# EAGLE design Window (EAGLE 6.6.0)
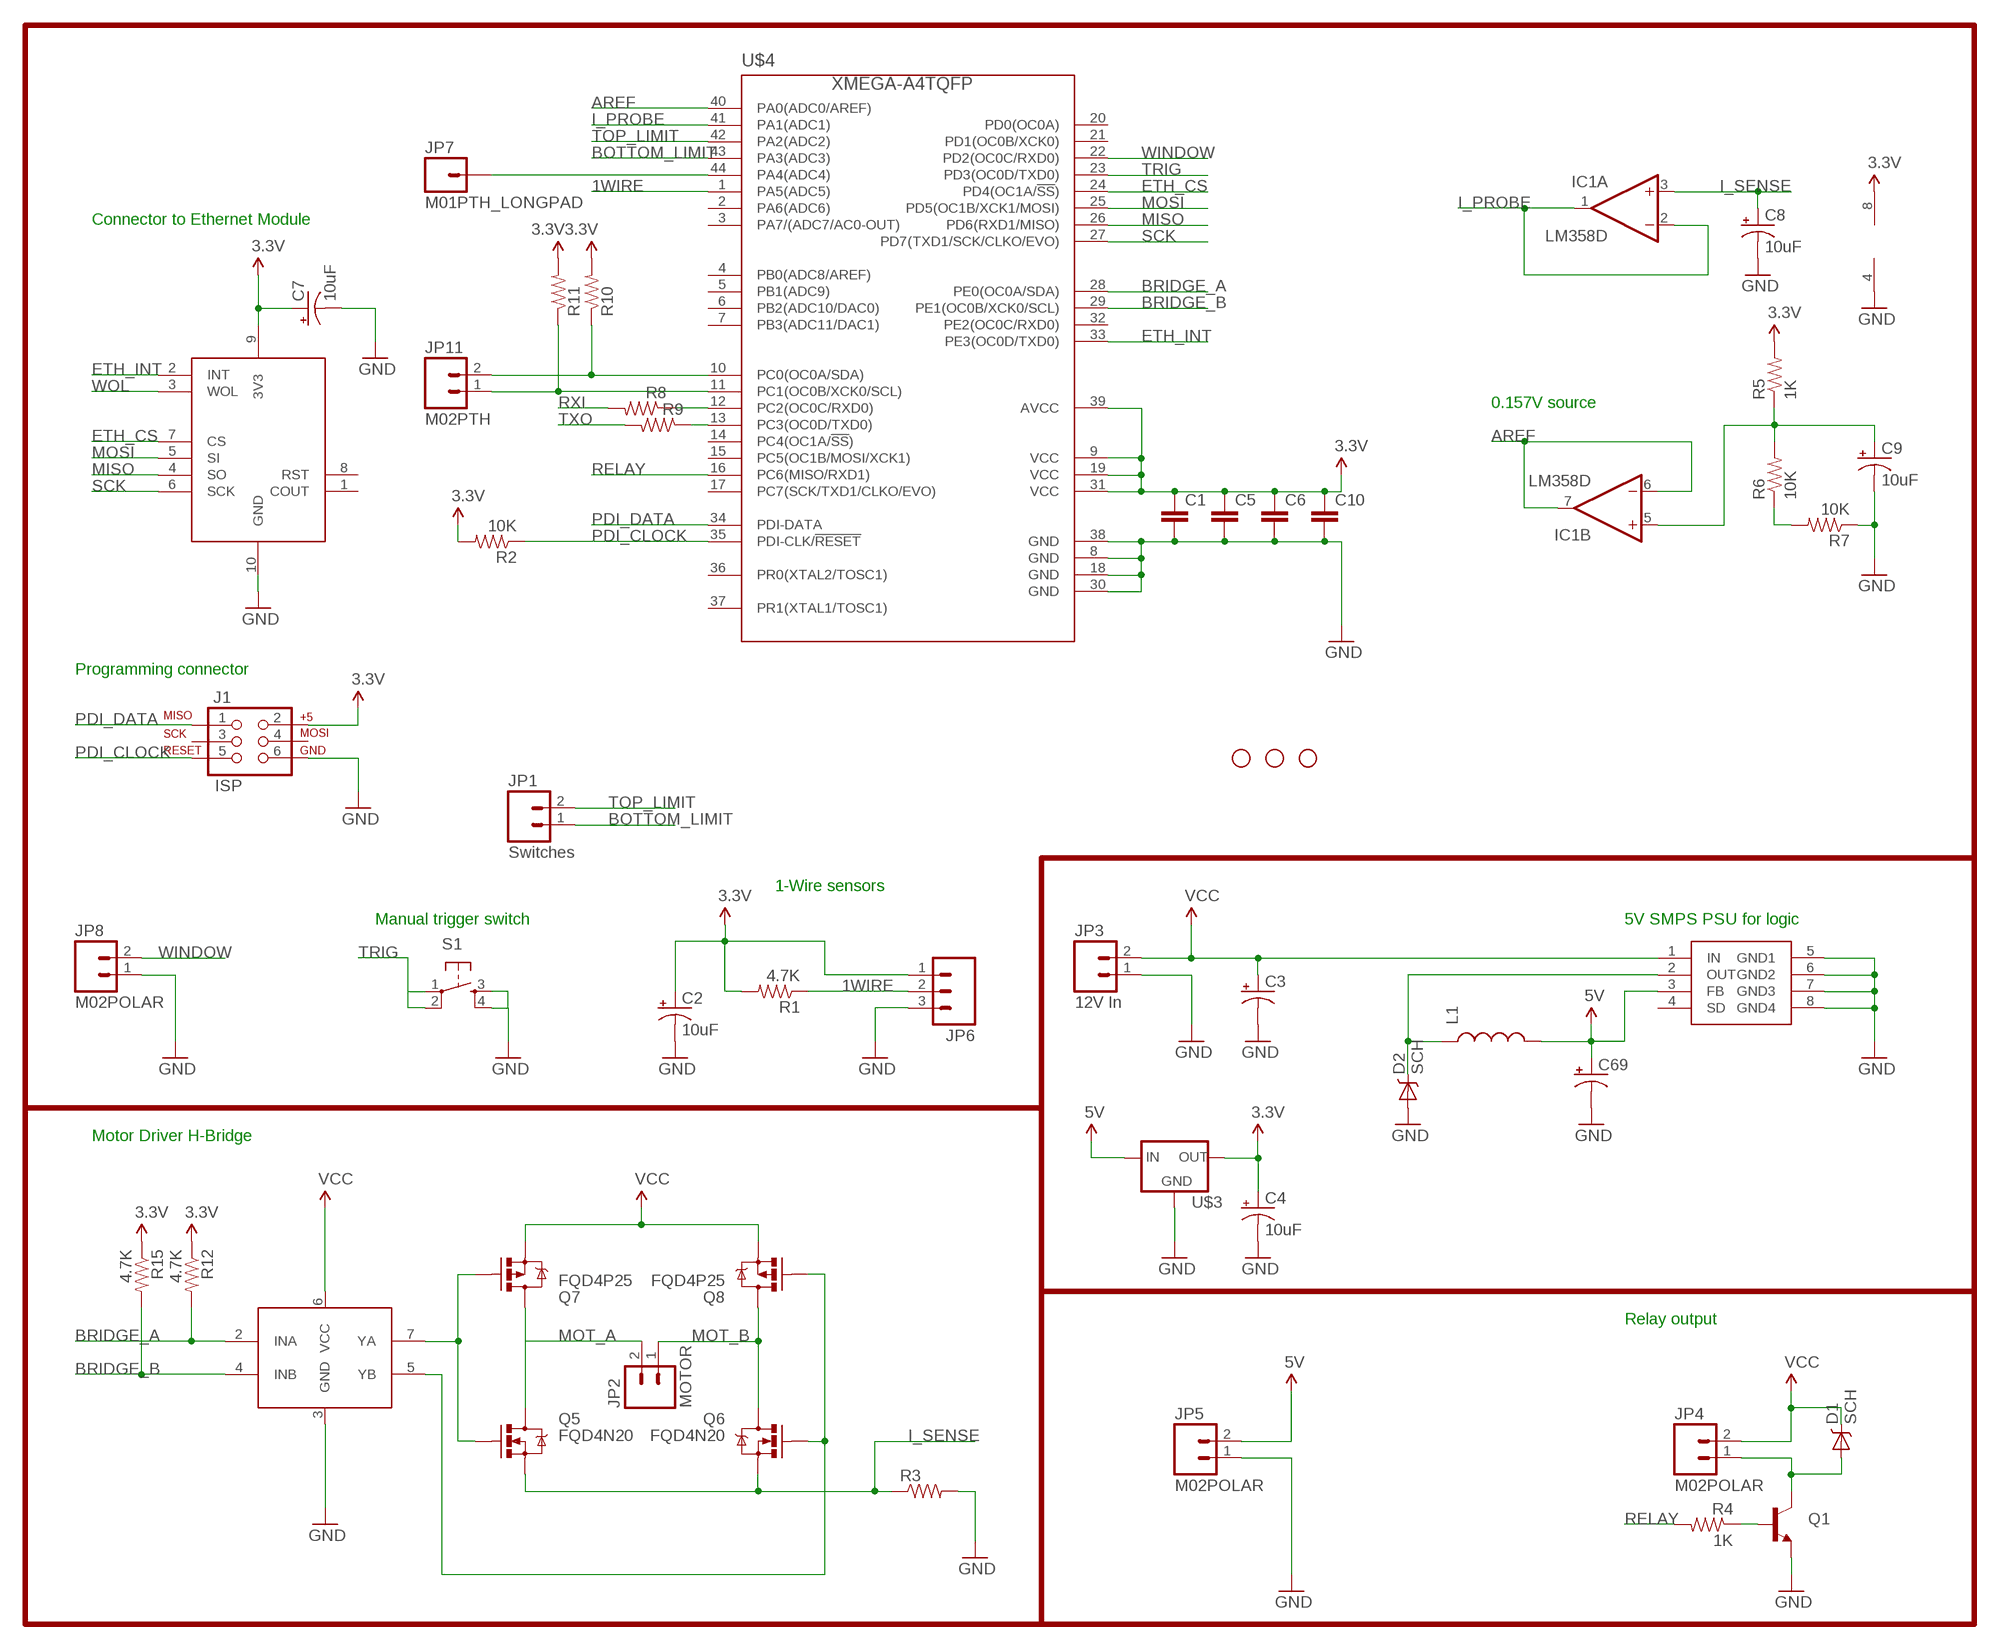
[diagram p0: schematic, sheet 1, part 1 of 2]
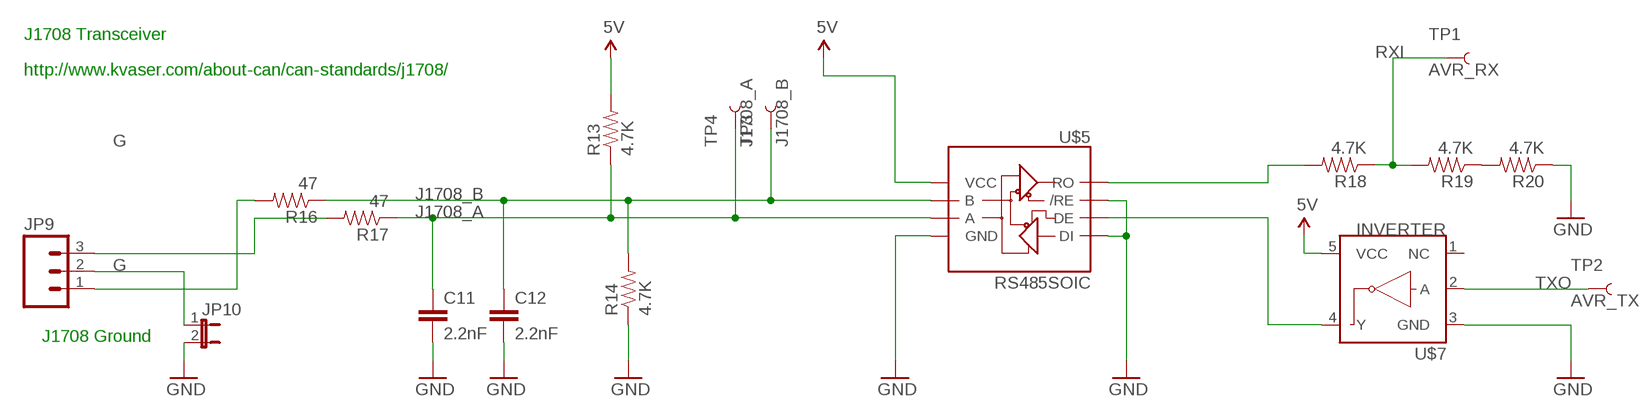
[diagram p1: schematic, sheet 1, part 2 of 2]

## Parts
C1  CAP0603-CAP  [0603-CAP]
C2  10uF  CAP_POL1206  [EIA3216]
C3  CAP_POLPTH1  [CPOL-RADIAL-100UF-25V]
C4  10uF  CAP_POL1206  [EIA3216]
C5  CAP0603-CAP  [0603-CAP]
C6  CAP0603-CAP  [0603-CAP]
C7  10uF  CAP_POL1206  [EIA3216]
C8  10uF  CAP_POL1206  [EIA3216]
C9  10uF  CAP_POL1206  [EIA3216]
C10  CAP0603-CAP  [0603-CAP]
C11  2.2nF  CAP0603-CAP  [0603-CAP]
C12  2.2nF  CAP0603-CAP  [0603-CAP]
C69  CAP_POLPTH1  [CPOL-RADIAL-100UF-25V]
D1  SCH  DIODE-SCHOTTKY_  [SMA-DIODE]
D2  SCH  DIODE-SCHOTTKY_  [SMA-DIODE]
IC1  LM358D  [SO08]
J1  ISP  AVR_SPI_PRG_6PTH  [2X3]
JP1  Switches  M023.5MM  [SCREWTERMINAL-3.5MM-2]
JP2  MOTOR  M023.5MM  [SCREWTERMINAL-3.5MM-2]
JP3  12V In  M023.5MM  [SCREWTERMINAL-3.5MM-2]
JP4  M02POLAR  [MOLEX-1X2]
JP5  M02POLAR  [MOLEX-1X2]
JP6  M03POLAR  [MOLEX-1X3]
JP7  M01PTH_LONGPAD  [1X01_LONGPAD]
JP8  M02POLAR  [MOLEX-1X2]
JP9  M03POLAR  [MOLEX-1X3]
JP10  JUMPER-2PTH  [1X02]
JP11  M02PTH  [1X02]
L1  INDUCTOR1206H*  [INDUCTOR-1206]
Q1  TRANSISTOR_NPNSOT23  [SOT23]
Q5  FQD4N20  MOSFET-NCHANNELFDD8780  [DPAK]
Q6  FQD4N20  MOSFET-NCHANNELFDD8780  [DPAK]
Q7  FQD4P25  MOSFET-PCHANNEL  [DPAK]
Q8  FQD4P25  MOSFET-PCHANNEL  [DPAK]
R1  4.7K  RESISTOR1206  [1206]
R2  10K  RESISTOR1206  [1206]
R3  RESISTORPTH-1W  [AXIAL-0.6]
R4  1K  RESISTOR1206  [1206]
R5  1K  RESISTOR1206  [1206]
R6  10K  RESISTOR1206  [1206]
R7  10K  RESISTOR1206  [1206]
R8  RESISTOR0603-RES  [0603-RES]
R9  RESISTOR0603-RES  [0603-RES]
R10  RESISTOR0603-RES  [0603-RES]
R11  RESISTOR0603-RES  [0603-RES]
R12  4.7K  RESISTOR1206  [1206]
R13  4.7K  RESISTOR1206  [1206]
R14  4.7K  RESISTOR1206  [1206]
R15  4.7K  RESISTOR1206  [1206]
R16  47  RESISTOR1206  [1206]
R17  47  RESISTOR1206  [1206]
R18  4.7K  RESISTOR1206  [1206]
R19  4.7K  RESISTOR1206  [1206]
R20  4.7K  RESISTOR1206  [1206]
S1  TAC_SWITCHPTH  [TACTILE-PTH]
STANDOFF2  STAND-OFF  [STAND-OFF]
STANDOFF3  STAND-OFF  [STAND-OFF]
STANDOFF4  STAND-OFF  [STAND-OFF]
TP1  AVR_RX  TEST-POINT3X5  [PAD.03X.05]
TP2  AVR_TX  TEST-POINT3X5  [PAD.03X.05]
TP3  J1708_B  TEST-POINT3X5  [PAD.03X.05]
TP4  J1708_A  TEST-POINT3X5  [PAD.03X.05]
U$1  ETHMODULE  [2X5]
U$2  AP1509-33  [SOIC-8]
U$3  V_REG_MIC2920  [SOT223]
U$4  XMEGA-A4TQFP  [TQFP44]
U$5  RS485SOIC  [SO08]
U$6  4427  [SOIC-8]
U$7  INVERTER  [SOT23-5]

## Nets
1WIRE: JP6.2 R1.1 U$4.1(PA5(ADC5))
3.3V: C1.1 C2.A(+) C4.A(+) C5.1 C6.1 C7.A(+) C10.1 IC1.8(P:V+) J1.2 JP6.1 R1.2 R2.2 R5.2 R10.2 R11.2 R12.1 R15.1 U$1.9(3V3) U$3.3(OUT) U$4.9(VCC) U$4.19(VCC) U$4.31(VCC) U$4.39(AVCC)
5V: C69.1(+) JP5.2 L1.P$2 R13.2 U$2.3(FB) U$3.1(IN) U$5.8(VCC) U$7.5(VCC)
AREF: IC1.6(B:-IN) IC1.7(B:OUT) U$4.40(PA0(ADC0/AREF))
BOTTOM_LIMIT: JP1.1 U$4.43(PA3(ADC3))
BRIDGE_A: R12.2 U$4.28(PE0(OC0A/SDA)) U$6.2(INA)
BRIDGE_B: R15.2 U$4.29(PE1(OC0B/XCK0/SCL)) U$6.4(INB)
ETH_CS: U$1.7(CS) U$4.24(PD4(OC1A/!SS!))
ETH_INT: U$1.2(INT) U$4.33(PE3(OC0D/TXD0))
G: JP9.2 JP10.1
GND: C1.2 C2.C(-) C3.2(-) C4.C(-) C5.2 C6.2 C7.C(-) C8.C(-) C9.C(-) C10.2 C11.2 C12.2 C69.2(-) D2.A IC1.4(P:V-) J1.6 JP3.1 JP5.1 JP6.3 JP8.1 JP10.2 Q1.2(E) R3.P$2 R7.1 R14.1 R20.1 S1.3 S1.4 U$1.10(GND) U$2.5(GND1) U$2.6(GND2) U$2.7(GND3) U$2.8(GND4) U$3.2(GND) U$4.8(GND) U$4.18(GND) U$4.30(GND) U$4.38(GND) U$5.2(/RE) U$5.4(DI) U$5.5(GND) U$6.3(GND) U$7.3(GND)
I_PROBE: IC1.1(A:OUT) IC1.2(A:-IN) U$4.41(PA1(ADC1))
I_SENSE: C8.A(+) IC1.3(A:+IN) Q5.3(S) Q6.3(S) R3.P$1
J1708_A: C11.1 R13.1 R17.1 TP4.P$1 U$5.6(A)
J1708_B: C12.1 R14.2 R16.1 TP3.P$1 U$5.7(B)
MISO: U$1.4(SO) U$4.26(PD6(RXD1/MISO))
MOSI: U$1.5(SI) U$4.25(PD5(OC1B/XCK1/MOSI))
MOT_A: JP2.2 Q5.4(D) Q7.4(D)
MOT_B: JP2.1 Q6.4(D) Q8.4(D)
N$1: JP11.2 R10.1 U$4.10(PC0(OC0A/SDA))
N$2: JP11.1 R11.1 U$4.11(PC1(OC0B/XCK0/SCL))
N$3: D2.C L1.P$1 U$2.2(OUT)
N$4: R8.1 U$4.12(PC2(OC0C/RXD0))
N$5: D1.A JP4.1 Q1.3(C)
N$6: JP9.1 R16.2
N$7: R6.1 R7.2
N$8: Q5.1(G) Q7.1(G) U$6.7(YA)
N$9: Q1.1(B) R4.1
N$10: C9.A(+) IC1.5(B:+IN) R5.1 R6.2
N$11: R9.1 U$4.13(PC3(OC0D/TXD0))
N$12: JP9.3 R17.2
N$13: R18.2 U$5.1(RO)
N$14: R19.1 R20.2
N$15: Q6.1(G) Q8.1(G) U$6.5(YB)
N$16: U$5.3(DE) U$7.4(Y)
N$17: JP7.1 U$4.44(PA4(ADC4))
PDI_CLOCK: J1.5 R2.1 U$4.35(PDI-CLK/!RESET)
PDI_DATA: J1.1 U$4.34(PDI-DATA)
RELAY: R4.2 U$4.16(PC6(MISO/RXD1))
RXI: R8.2 R18.1 R19.2 TP1.P$1
SCK: U$1.6(SCK) U$4.27(PD7(TXD1/SCK/CLKO/EVO))
TOP_LIMIT: JP1.2 U$4.42(PA2(ADC2))
TRIG: S1.1 S1.2 U$4.23(PD3(OC0D/TXD0))
TXO: R9.2 TP2.P$1 U$7.2(A)
VCC: C3.1(+) D1.C JP3.2 JP4.2 Q7.3(S) Q8.3(S) U$2.1(IN) U$6.6(VCC)
WINDOW: JP8.2 U$4.22(PD2(OC0C/RXD0))
WOL: U$1.3(WOL)
Unconnected: J1.3 J1.4 U$2.4(SD) U$4.2(PA6(ADC6)) U$4.3(PA7/(ADC7/AC0-OUT)) U$4.4(PB0(ADC8/AREF)) U$4.5(PB1(ADC9)) U$4.6(PB2(ADC10/DAC0)) U$4.7(PB3(ADC11/DAC1)) U$4.14(PC4(OC1A/!SS!)) U$4.15(PC5(OC1B/MOSI/XCK1)) U$4.17(PC7(SCK/TXD1/CLKO/EVO)) U$4.20(PD0(OC0A)) U$4.21(PD1(OC0B/XCK0)) U$4.32(PE2(OC0C/RXD0)) U$4.36(PR0(XTAL2/TOSC1)) U$4.37(PR1(XTAL1/TOSC1)) U$7.1(NC)

## Notes on the sheet
- Connector to Ethernet Module
- 0.157V source
- Programming connector
- 1-Wire sensors
- Manual trigger switch | 5V SMPS PSU for logic
- Motor Driver H-Bridge
- J1708 Transceiver
- http://www.kvaser.com/about-can/can-standards/j1708/
- Relay output
- J1708 Ground

## Power pins joined to a net without a drawn wire
COUT: U$1.1(COUT)
RST: U$1.8(RST)

## Library data of the parts
C1 C5 C6 C10-C12 = 1_SparkFun-Capacitors:CAP: Capacitor Standard 0603 ceramic capacitor, and 0.1" leaded capacitor.
C2-C4 C7-C9 C69 = 1_SparkFun-Capacitors:CAP_POL: Capacitor Polarized These are standard SMD and PTH capacitors. Normally 10uF, 47uF, and 100uF in electrolytic and tantalum varieties. Always verify the external diameter of the through hole cap, it varies with capacity, voltage, and manufacturer. The EIA devices should be standard.
D1 D2 = 1_SparkFun-DiscreteSemi:DIODE-SCHOTTKY: Commonly MBRA140.
IC1 = linear:LM358: OP AMP also LM158; LM258; LM2904 Source: http://cache.national.com/ds/LM/LM158.pdf
J1 = 1_SparkFun-Connectors:AVR_SPI_PRG_6: AVR ISP 6 Pin This is the reduced ISP connector for AVR programming. Common on Arduino. This footprint will take up less PCB space and can be used with a 10-pin to 6-pin adapter such as SKU: BOB-08508
JP1-JP5 JP8 JP11 = 1_SparkFun-Connectors:M02: Standard 2-pin 0.1" header. Use with - straight break away headers ( PRT-00116) - right angle break away headers (PRT-00553) - swiss pins (PRT-00743) - machine pins (PRT-00117) - female headers (PRT-00115) Molex polarized connector foot print use with: PRT-08233 with associated crimp pins and housings. 2.54_SCREWTERM for use with PRT-10571. 3.5mm Screw Terminal footprints for PRT-08084 5mm Screw Terminal footprints for use with PRT-08433
JP6 JP9 = 1_SparkFun-Connectors:M03: Header 3 Standard 3-pin 0.1" header. Use with straight break away headers (SKU : PRT-00116), right angle break away headers (PRT-00553), swiss pins (PRT-00743), machine pins (PRT-00117), and female headers (PRT-00115). Molex polarized connector foot print use with SKU : PRT-08232 with associated crimp pins and housings.
JP7 = 1_SparkFun-Connectors:M01: Header 1 Standard 1-pin 0.1" header. Use with straight break away headers (SKU : PRT-00116), right angle break away headers (PRT-00553), swiss pins (PRT-00743), machine pins (PRT-00117), and female headers (PRT-00115).
JP10 = 1_SparkFun-Passives:JUMPER-2: Jumper Basic 0.1" spaced jumper. Use with breakaway headers.
L1 = 1_SparkFun-Passives:INDUCTOR: Inductors Basic Inductor/Choke - 0603 and 1206. Footprints are not proven and vary greatly between part numbers. SRN6045- 33uH, 20% 1.4A SDR0403-560KL - 56uH, 10%, 500mA RMS/740mA peak
Q1 = 1_SparkFun-DiscreteSemi:TRANSISTOR_NPN: Generic NPN BJT MMBT2222A - TRANS-08049 (SOT-23, 1A 40V) MPSA42 - TRANS-09116 (SOT-23, 500mA 300V) MMBT5088LT1G - TRANS-11160 (SOT-23, 50 mA 30V)
Q5 Q6 = 1_SparkFun-DiscreteSemi:MOSFET-NCHANNEL: Common NMOSFET Parts MFG P/N Store ID Prod ID FDD8780 TRANS-09984 SI7820DN TRANS-11055 FDS6630A IC-08089 2N7002PW TRANS-11151 FQP30N06L COM-10213 TRANS-10060 BSS123LT1G TRANS-08345 BSS138 TRANS-00830 BS170 2N7000; PROD_ID: TRANS-09984
Q7 Q8 = 1_SparkFun-DiscreteSemi:MOSFET-PCHANNEL: Generic PMOSFET
R1-R20 = 1_SparkFun-Resistors:RESISTOR: Resistor Basic schematic elements and footprints for 0603, 1206, and PTH resistors.
S1 = 1_SparkFun-Electromechanical:TAC_SWITCH: Momentary Switch Button commonly used for reset or general input. Spark Fun Electronics SKU : COM-00097 SMT- SWCH-08247
STANDOFF2-STANDOFF4 = 1_SparkFun-Electromechanical:STAND-OFF: #4 Stand Off This is the mechanical footprint for a #4 phillips button head screw. Use the keepout ring to avoid running the screw head into surrounding components. SKU : PRT-00447
TP1-TP4 = 1_SparkFun-Passives:TEST-POINT: Bare copper test points for troubleshooting or ICT
U$1 = 0_Tristan's_Lib:ETHMODULE
U$2 = 0_Tristan's_Lib:AP1509-33
U$3 = 1_SparkFun-PowerIC:V_REG_MIC2920: MIC2920A (http://www.micrel.com/_PDF/mic2920.pdf) - 400mA output LDO Regulator
U$4 = avr-7:XMEGA-A4: Atmel XMega A4 series processor
U$5 = 1_SparkFun-DigitalIC:RS485: RS485 transceiver
U$6 = 0_Tristan's_Lib:4427: MOSFET driver IC
U$7 = 1_SparkFun-DigitalIC:INVERTER: Single inverter, SOT23-5

## Board
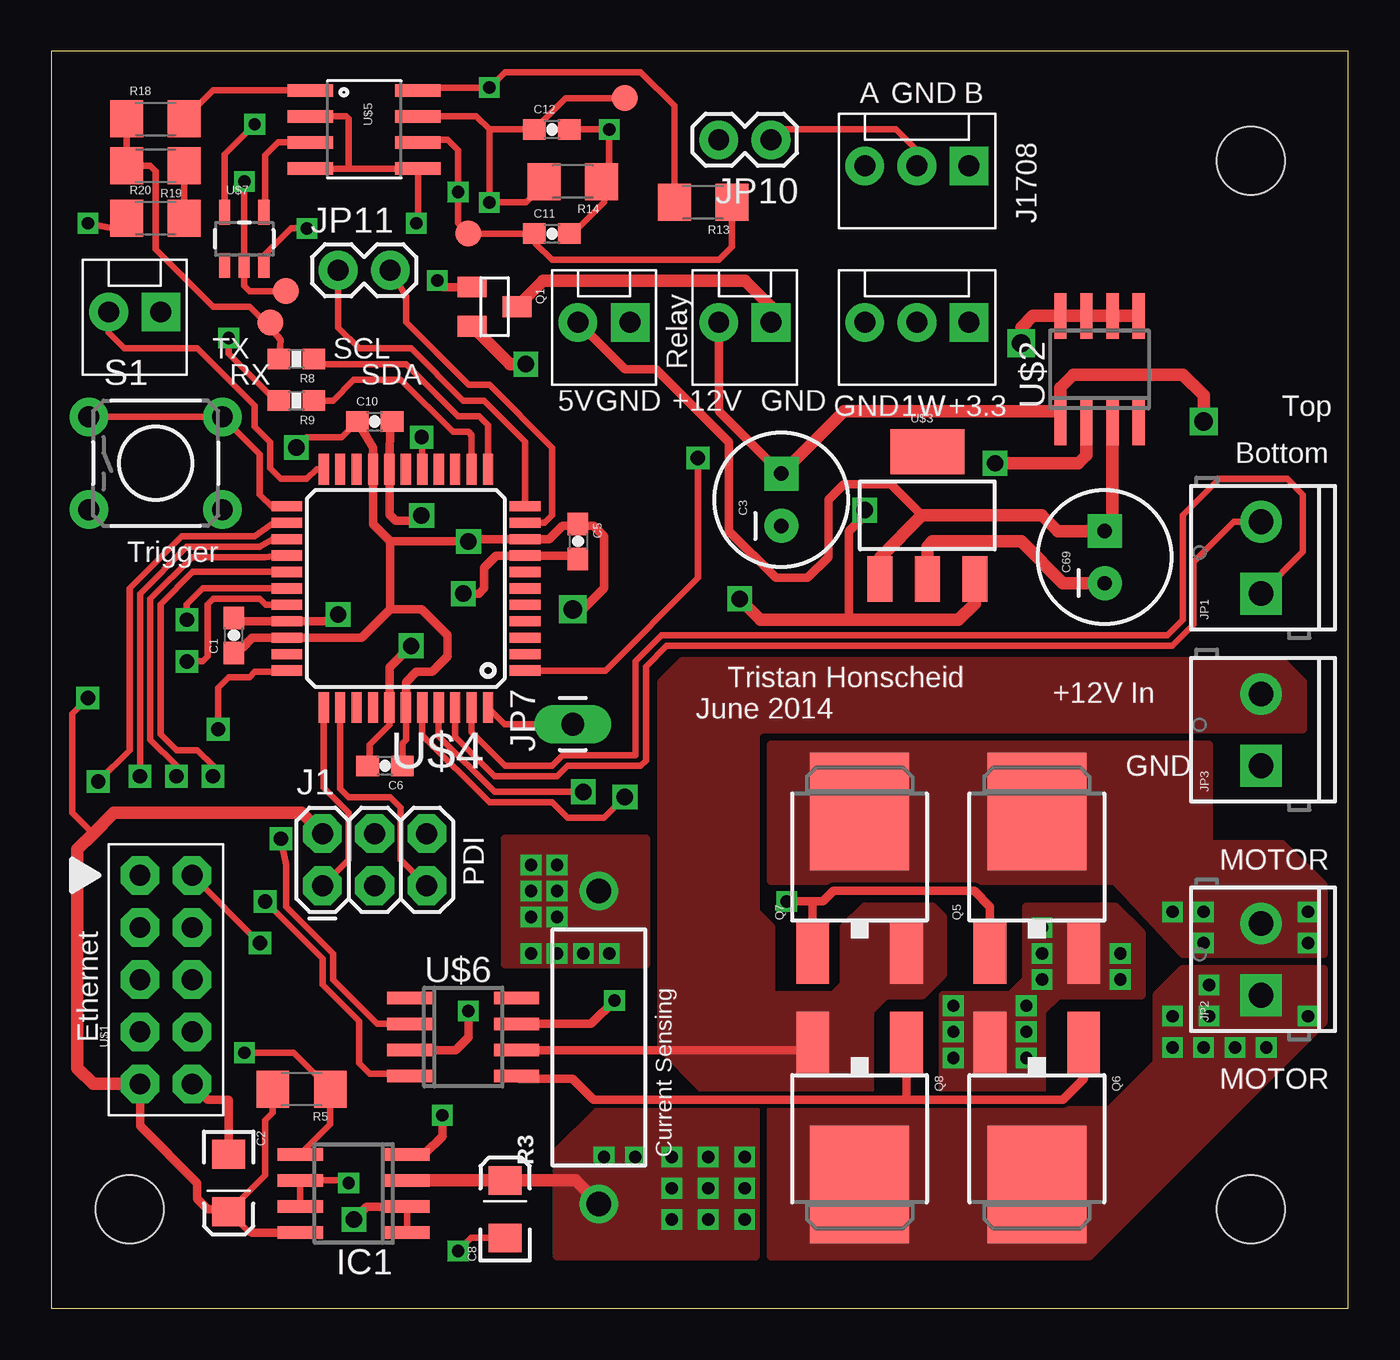
[diagram p2: board, top side]
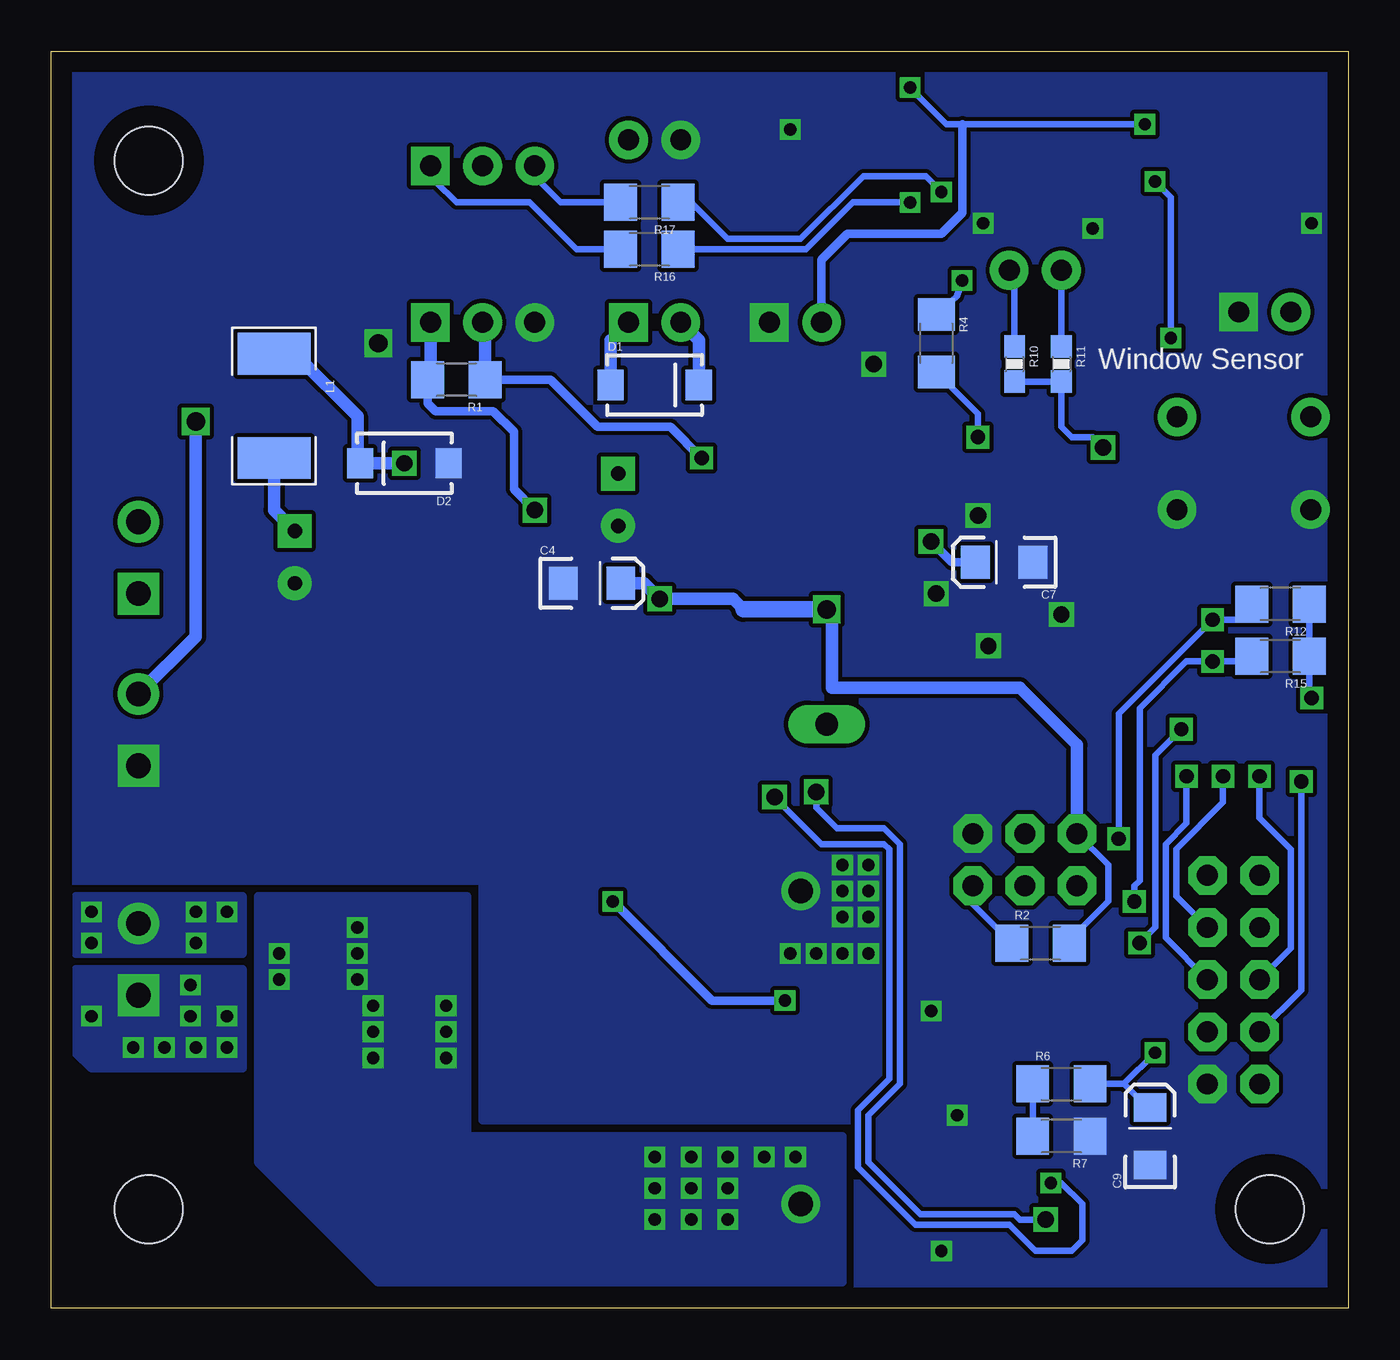
[diagram p3: board, bottom side, seen from below]

Size 63.17 x 61.2 mm. Coordinates in mm from the lower left corner, seen from the top.
Outline: 0,0 63.17,0 63.17,61.2 0,61.2 0,0
Copper layers (1*16): Top 0.035mm / dielectric 1.5mm / Bottom 0.035mm
Design rules "default": minimum track width 10mil, minimum drill 24mil, track to track 8mil, track to pad 8mil, pad to pad 8mil, via to via 8mil, smd to smd 8mil, copper to edge 40mil, drill to drill 8mil, minimum pad ring 10mil, minimum via ring 8mil, stop-mask expansion 4mil, vias tented up to drill 0mil, thermal gap 10mil

### Footprints (pad centres in the part's own frame; a part is rotated, then mirrored left to right if it is on the bottom)
0603-CAP = smd 1.1 x 1: 1 -0.85,0; 2 0.85,0
EIA3216 = smd 1.4 x 1.6: A 1.4,0; C -1.4,0
CPOL-RADIAL-100UF-25V = drill 0.7 pad 1.651 square: 1 1.27,0 | drill 0.7 pad 1.651: 2 -1.27,0
SMA-DIODE = smd 1.27 x 1.47: A -2.15,0; C 2.15,0
SO08 = smd 0.6 x 2.2: 1 -1.905,-2.6; 2 -0.635,-2.6; 3 0.635,-2.6; 4 1.905,-2.6; 5 1.905,2.6; 6 0.635,2.6; 7 -0.635,2.6; 8 -1.905,2.6
2X3 = drill 1.016 pad 1.88 octagon: 1 0,0; 2 0,2.54; 3 2.54,0; 4 2.54,2.54; 5 5.08,0; 6 5.08,2.54
SCREWTERMINAL-3.5MM-2 = drill 1.2 pad 2.032 square: 1 0,0 | drill 1.2 pad 2.032: 2 3.5,0
MOLEX-1X2 = drill 1.016 pad 1.88 square: 1 0,0 | drill 1.016 pad 1.88: 2 2.54,0
MOLEX-1X3 = drill 1.016 pad 1.88 square: 1 0,0 | drill 1.016 pad 1.88: 2 2.54,0; 3 5.08,0
1X01_LONGPAD = drill 1.118 pad 1.88 long: 1 0,0
1X02 = drill 1.016 pad 1.88: 1 0,0; 2 2.54,0
INDUCTOR-1206 = smd 2.032 x 3.556: P$1 -2.54,0; P$2 2.54,0
SOT23 = smd 1 x 1.4: 1 -0.95,-1.1; 2 0.95,-1.1; 3 0,1.1
DPAK = smd 1.6 x 3: 1 -2.28,-5.31; 3 2.28,-5.31 | smd 4.826 x 5.715: 4 0,1.588
1206 = smd 1.6 x 1.8: 1 -1.4,0; 2 1.4,0
AXIAL-0.6 = drill 1.2 pad 1.88: P$1 -7.62,0; P$2 7.62,0
0603-RES = smd 1.1 x 1: 1 -0.85,0; 2 0.85,0
TACTILE-PTH = drill 1.016 pad 1.88: 1 -3.251,2.261; 2 3.251,2.261; 3 -3.251,-2.261; 4 3.251,-2.261
STAND-OFF = hole 3.302: 0,0
PAD.03X.05 = smd 1.27 x 1.27: P$1 0,0
2X5 = drill 1.016 pad 1.88 octagon: 1 -1.27,5.08; 2 1.27,5.08; 3 -1.27,2.54; 4 1.27,2.54; 5 -1.27,0; 6 1.27,0; 7 -1.27,-2.54; 8 1.27,-2.54; 9 -1.27,-5.08; 10 1.27,-5.08
SOIC-8 = smd 0.6 x 2.2: 1 -1.905,-2.6; 2 -0.635,-2.6; 3 0.635,-2.6; 4 1.905,-2.6; 5 1.905,2.6; 6 0.635,2.6; 7 -0.635,2.6; 8 -1.905,2.6
SOT223 = smd 1.219 x 2.235: 1 -2.311,-3.099; 2 0,-3.099; 3 2.311,-3.099 | smd 3.6 x 2.2: 4 0,3.099
TQFP44 = smd 1.5 x 0.5: 1 -5.8,4; 2 -5.8,3.2; 3 -5.8,2.4; 4 -5.8,1.6; 5 -5.8,0.8; 6 -5.8,0; 7 -5.8,-0.8; 8 -5.8,-1.6; 9 -5.8,-2.4; 10 -5.8,-3.2; 11 -5.8,-4; 23 5.8,-4; 24 5.8,-3.2; 25 5.8,-2.4; 26 5.8,-1.6; 27 5.8,-0.8; 28 5.8,0; 29 5.8,0.8; 30 5.8,1.6; 31 5.8,2.4; 32 5.8,3.2; 33 5.8,4 | smd 0.5 x 1.5: 12 -4,-5.8; 13 -3.2,-5.8; 14 -2.4,-5.8; 15 -1.6,-5.8; 16 -0.8,-5.8; 17 0,-5.8; 18 0.8,-5.8; 19 1.6,-5.8; 20 2.4,-5.8; 21 3.2,-5.8; 22 4,-5.8; 34 4,5.8; 35 3.2,5.8; 36 2.4,5.8; 37 1.6,5.8; 38 0.8,5.8; 39 0,5.8; 40 -0.8,5.8; 41 -1.6,5.8; 42 -2.4,5.8; 43 -3.2,5.8; 44 -4,5.8
SO08' = smd 0.61 x 2.21: 1 -1.905,-2.616; 2 -0.635,-2.616; 3 0.635,-2.616; 4 1.905,-2.616; 5 1.905,2.616; 6 0.635,2.616; 7 -0.635,2.616; 8 -1.905,2.616
SOT23-5 = smd 0.55 x 1.2: 1 -0.95,-1.3; 2 0,-1.3; 3 0.95,-1.3; 4 0.95,1.3; 5 -0.95,1.3

### Placement (x,y rotation side)
C1  8.89,32.77 90 top
C2  8.64,6.1 270 top
C3  35.56,39.37 90 top
C4  36.83,35.31 0 bottom
C5  25.65,37.34 270 top
C6  16.26,26.42 180 top
C7  16.76,36.32 180 bottom
C8  22.1,4.83 90 top
C9  9.65,8.38 90 bottom
C10  15.75,43.18 0 top
C11  24.38,52.32 0 top
C12  24.38,57.4 0 top
C69  51.31,36.58 90 top
D1  33.78,44.96 0 bottom
D2  45.97,41.15 180 bottom
IC1  14.73,5.59 90 top
J1  13.21,20.57 0 top
JP1  58.93,34.8 90 top
JP2  58.93,15.24 90 top
JP3  58.93,26.42 90 top
JP4  35.05,48.01 180 top
JP5  28.19,48.01 180 top
JP6  44.7,48.01 180 top
JP7  25.4,28.45 90 top
JP8  5.33,48.51 180 top
JP9  44.7,55.63 180 top
JP10  35.05,56.9 180 top
JP11  13.97,50.55 0 top
L1  52.32,43.94 270 bottom
Q1  21.59,48.77 270 top
Q5  48.01,22.61 0 top
Q6  48.01,7.62 180 top
Q7  39.37,22.61 0 top
Q8  39.37,7.62 180 top
R1  43.43,45.21 180 bottom
R2  14.99,17.78 0 bottom
R3  26.67,12.7 90 top
R4  20.07,46.99 270 bottom
R5  12.19,10.67 180 top
R6  13.97,10.92 0 bottom
R7  13.97,8.38 180 bottom
R8  11.94,46.23 180 top
R9  11.94,44.2 180 top
R10  16.26,45.97 270 bottom
R11  13.97,45.97 270 bottom
R12  3.3,34.29 180 bottom
R13  31.75,53.85 180 top
R14  25.4,54.86 180 top
R15  3.3,31.75 180 bottom
R16  34.04,51.56 180 bottom
R17  34.04,53.85 180 bottom
R18  5.08,57.91 0 top
R19  5.08,55.63 180 top
R20  5.08,53.09 0 top
S1  5.08,41.15 0 top
STANDOFF2  58.42,55.88 0 top
STANDOFF3  58.42,4.83 0 top
STANDOFF4  3.81,4.83 0 top
TP1  10.67,48.01 0 top
TP2  11.43,49.53 0 top
TP3  27.94,58.93 0 top
TP4  20.32,52.32 0 top
U$1  5.59,16 0 top
U$2  51.05,45.72 0 top
U$3  42.67,38.61 0 top
U$4  17.27,35.05 180 top
U$5  RS485SOIC  [SO08']  15.24,57.4 270 top
U$6  20.07,13.21 270 top
U$7  9.4,52.07 0 top

### Tracks (layer width: path | path; a pad name or v marks a point on that pad's centre or on a via)
1WIRE  (via drill 0.7)
  Top 0.305: U$4.1 26.99,31.05 31.5,35.56 v31.5,41.4
  Bottom 0.406: R1.1 38.86,45.21 36.58,42.93 33.02,42.93 v31.5,41.4
  Bottom 0.61: R1.1 42.03,47.88 JP6.2
3.3V  (via drill 0.7, 0.8, 0.9 pad 0.81)
  Top 0.305: 9.78,3.68 9.65,3.68 C2.A 10.41,6.47 10.41,9.14 10.79,9.52 R5.2 | C6.1 17.11,27.52 17.27,27.69 U$4.39 | v11.94,41.91 12.45,42.42 14.14,42.42 C10.1 | v1.78,29.72 1.02,28.96 1.02,24.13 2.03,23.11
  Top 0.406: IC1.8 9.78,3.68 | U$1.9 4.32,8.89 7.11,6.1 7.11,5.33 7.62,4.83 8.51,4.83 C2.A | 16.51,37.34 15.67,38.18 U$4.19 15.67,41.9 C10.1 | 16.51,37.34 v20.32,37.34 20.43,37.45 U$4.9 24.24,37.45 24.89,38.1 25.57,38.1 C5.1 25.74,38.1 26.42,38.1 26.92,37.59 26.92,35.05 25.91,34.04 v25.4,34.04 | 16.51,34.04 15.13,32.65 U$4.31 9.79,32.65 9.31,32.17 C1.1 | 16.51,34.04 16.51,37.34 | U$4.39 17.27,30.48 17.78,30.99 18.54,30.99 19.3,31.75 19.3,32.77 18.03,34.04 16.51,34.04 | v39.62,38.86 39.62,38.61 38.86,37.85 38.86,33.78 39.12,33.53
  Top 0.61: U$1.9 2.03,10.92 1.27,11.68 1.27,22.35 2.03,23.11 3.05,24.13 12.19,24.13 J1.2 | U$3.3 44.98,34.31 44.2,33.53 39.12,33.53 34.54,33.53 v33.53,34.54
  Bottom 0.305: R2.2 13.59,17.91 11.68,19.81 11.68,21.59 J1.2 | R10.2 R11.2 13.97,42.93 13.46,42.42 12.45,42.42 v11.94,41.91 | R12.1 R15.1 1.9,29.84 v1.78,29.72
  Bottom 0.406: R1.2 44.83,44.07 44.45,43.69 41.66,43.69 40.64,42.67 40.64,39.88 v39.62,38.86 | C7.A 19.3,36.32 v20.32,37.34
  Bottom 0.61: J1.2 13.21,27.43 16,30.23 25.15,30.23 25.15,33.78 v25.4,34.04 | 29.46,34.04 29.97,34.54 v33.53,34.54 34.29,35.31 C4.A | JP6.1 44.7,45.34 R1.2
  Bottom 0.813: v25.4,34.04 29.46,34.04
5V  (via drill 0.6)
  Top 0.305: U$7.5 8.45,56.2 v9.91,57.66 | U$5.8 17.98,59.44 v21.34,59.44 22.1,60.2 28.7,60.2 30.35,58.55 R13.2
  Top 0.406: 42.42,38.61 40.89,40.13 38.61,40.13 37.85,39.37 37.85,36.58 36.83,35.56 35.31,35.56 33.02,37.85 33.02,42.16 29.46,45.72 27.94,45.72 JP5.2
  Top 0.61: U$2.3 51.69,38.23 C69.1 49.02,37.85 48.26,38.61 42.42,38.61 40.39,36.58 40.39,35.03 U$3.1
  Bottom 0.305: v9.91,57.66 18.8,57.66 19.56,57.66 v21.34,59.44
  Bottom 0.406: JP5.2 25.65,51.05 24.38,52.32 19.81,52.32 18.8,53.34 18.8,57.66
  Bottom 0.61: L1.P$2 52.32,38.86 C69.1
AREF  (via drill 0.6, 0.8)
  Top 0.305: IC1.7 IC1.6 14.35,6.22 v14.48,6.1 | U$4.40 18.07,27.9 21.34,24.64 24.38,24.64 25.15,23.88 26.92,23.88 v27.94,24.89
  Bottom 0.305: v14.48,6.1 13.97,6.1 12.95,5.08 12.95,3.3 13.46,2.79 15.24,2.79 16.51,4.06 21.08,4.06 23.88,6.86 23.88,9.65 22.35,11.18 22.35,22.35 22.61,22.61 25.65,22.61 v27.94,24.89
BOTTOM_LIMIT
  Top 0.305: JP1.1 60.96,36.83 60.96,39.62 60.2,40.39 56.9,40.39 55.12,38.61 55.12,33.53 54.36,32.77 29.72,32.77 28.45,31.5 28.45,26.92 24.89,26.92 24.38,26.42 22.1,26.42 20.47,28.04 U$4.43
BRIDGE_A  (via drill 0.7)
  Top 0.305: U$6.2 15.88,13.84 13.72,16 13.72,17.27 11.43,19.56 11.43,21.59 v11.18,22.86 | U$4.28 7.37,35.05 6.6,34.29 v6.6,33.53
  Bottom 0.305: v11.18,22.86 11.18,28.96 v6.6,33.53 5.46,33.53 R12.2
BRIDGE_B  (via drill 0.7)
  Top 0.305: U$4.29 10.45,34.25 10.16,34.54 7.87,34.54 7.62,34.29 7.62,31.75 7.37,31.5 v6.6,31.5 | U$6.4 17.4,11.3 17.27,11.43 15.49,11.43 14.99,11.94 14.99,13.97 13.21,15.75 13.21,17.02 v10.41,19.81
  Bottom 0.305: R15.2 4.96,31.5 v6.6,31.5 7.87,31.5 10.16,29.21 10.16,20.83 10.41,20.57 v10.41,19.81
ETH_CS  (via drill 0.7)
  Top 0.305: U$4.24 10.82,38.25 9.91,37.59 6.35,37.59 3.81,35.05 3.81,27.18 v2.29,25.65
  Bottom 0.305: v2.29,25.65 2.29,15.49 U$1.7
ETH_INT  (via drill 0.7)
  Top 0.305: U$1.2 v10.16,17.78 | v8.13,28.19 8.13,30.23 8.64,30.73 9.65,30.73 9.91,30.99 11.41,30.99 U$4.33
  Bottom 0.305: v10.16,17.78 9.4,18.54 9.4,26.92 v8.13,28.19
G
  Top 0.305: JP9.2 42.16,56.39 41.15,57.4 35.56,57.4 JP10.1
GND  (via drill 0.6, 0.8, 0.9)
  Top 0.305: C8.C 20.44,3.43 v19.81,2.79 | U$4.38 16.47,28.41 15.49,27.43 15.49,26.5 C6.2 | C12.2 v27.18,57.4 27.18,55.24 R14.1 26.92,54.74 26.92,53.85 25.4,52.32 C11.2 | U$5.4 14.48,55.5 | 14.48,55.5 U$5.5 17.86,53.26 v17.78,52.83 | U$5.2 14.35,58.04 14.48,57.91 14.48,55.5 | U$7.3 10.35,51.24 11.68,52.58 v12.45,52.58 | R20.1 3.68,52.45 v1.78,52.83
  Top 0.406: U$6.3 19.68,12.57 20.32,13.21 v20.32,14.48 | U$1.10 7.62,10.16 8.64,10.16 C2.C | IC1.4 18.16,7.49 19.05,8.38 v19.05,9.4 | v13.97,33.78 13.64,33.45 U$4.30 9.23,33.45 C1.2 | v18.03,38.61 17.78,38.35 16.76,38.35 16.47,38.65 U$4.18 16.47,41.87 16.51,42.42 16.51,43.09 C10.2 | v20.07,34.8 20.83,34.8 21.08,35.05 21.08,36.07 21.67,36.65 U$4.8 25.49,36.65 C5.2 | U$4.38 16.47,31.2 v17.53,32.26
  Top 0.61: U$2.5 U$2.6 U$2.7 U$2.8 47.81,48.32 47.24,47.75 v47.24,46.99 | U$3.2 42.67,37.08 42.93,37.34 47.24,37.34 49.28,35.31 C69.2 | v23.11,45.97 22.33,45.97 Q1.2
  other vias: 23.37,21.59 23.37,20.32 23.37,19.05 23.37,17.27 24.64,17.27 24.64,19.05 24.64,20.32 24.64,21.59 25.91,17.27 27.18,17.27
  pour Bottom (no thermals): 0.51,60.71 62.74,60.71 62.74,20.83 42.16,20.83 42.16,9.14 23.88,9.14 23.88,0.51 0.51,0.51
  pour Top (no thermals): 22.1,22.86 28.96,22.86 28.96,16.76 22.1,16.76
I_PROBE  (via drill 0.8)
  Top 0.305: IC1.1 IC1.2 | v25.91,25.15 21.59,25.15 18.87,27.86 U$4.41
  Top 0.406: IC1.2 15.37,4.95 v14.73,4.32
  Bottom 0.305: v14.73,4.32 16,4.32 16.26,4.57 20.83,4.57 23.37,7.11 23.37,9.4 21.84,10.92 21.84,22.61 22.61,23.37 24.89,23.37 25.91,24.38 v25.91,25.15
I_SENSE  (via drill 0.6)
  Top 0.61: IC1.3 C8.A 25.52,6.23 R3.P$1
  other vias: 52.07,16 52.07,17.27 48.26,16 48.26,17.27 48.26,18.54 47.5,14.73 47.5,13.46 47.5,12.19 43.94,14.73 43.94,13.46 43.94,12.19 30.23,7.37 32,7.37 33.78,7.37 30.23,5.84 32,5.84 33.78,5.84 30.23,4.32 32,4.32 33.78,4.32 28.45,7.37 26.92,7.37
  pour Top (no thermals): 43.43,10.67 48.26,10.67 48.26,14.48 49.02,15.24 53.09,15.24 53.09,18.29 51.82,19.56 47.5,19.56 47.5,16 46.74,15.24 43.43,15.24
  pour Bottom (no thermals): 24.64,1.27 24.64,8.38 42.93,8.38 42.93,20.07 53.09,20.07 53.09,7.11 47.24,1.27
  pour Top (no thermals): 24.64,7.62 26.67,9.65 34.29,9.65 34.29,2.54 24.64,2.54
J1708_A  (via drill 0.6)
  Top 0.305: U$5.6 17.98,56.9 19.3,56.9 19.81,56.39 v19.81,54.36 19.81,52.83 TP4.P$1 C11.1 23.62,52.24 23.62,51.82 24.38,51.05 32.51,51.05 33.15,51.69 R13.1
  Bottom 0.305: v19.81,54.36 20.57,55.12 23.62,55.12 26.67,52.07 30.23,52.07 32,53.85 R17.1
J1708_B  (via drill 0.6)
  Top 0.305: U$5.7 20.7,58.04 21.34,57.4 | 21.34,57.4 v21.34,53.85 23.11,53.85 24,54.73 R14.2 | C12.1 21.34,57.4 | 23.37,57.57 C12.1 | TP3.P$1 25.06,58.93 C12.1
  Bottom 0.305: v21.34,53.85 24.13,53.85 26.42,51.56 R16.1
MISO  (via drill 0.7)
  Top 0.305: v6.1,25.91 6.1,26.42 4.83,27.69 4.83,34.54 6.86,36.58 10.41,36.58 11,36.65 U$4.26
  Bottom 0.305: v6.1,25.91 6.1,24.64 8.38,22.35 8.38,20.07 U$1.4
MOSI  (via drill 0.7)
  Top 0.305: U$4.25 10.78,37.45 10.16,37.08 6.6,37.08 4.32,34.8 v4.32,25.91
  Bottom 0.305: v4.32,25.91 4.32,23.88 2.79,22.35 2.79,17.53 U$1.5
MOT_A  (via drill 0.6)
  other vias: 54.61,19.3 56.13,19.3 56.13,17.78 61.21,17.78 61.21,19.3
  pour Top (no thermals): 35.05,20.83 51.82,20.83 55.12,17.27 61.98,17.27 61.98,20.57 59.94,22.61 56.39,22.61 56.39,27.43 35.05,27.43
  pour Bottom (no thermals): 53.85,20.07 61.98,20.07 61.98,17.27 53.85,17.27
MOT_B  (via drill 0.6)
  other vias: 61.21,14.22 54.61,14.22 54.61,12.7 56.13,12.7 56.39,14.22 56.39,15.75 57.66,12.7 59.18,12.7
  pour Top (no thermals): 35.05,9.65 51.56,9.65 53.85,11.94 53.85,15.24 55.12,16.51 61.98,16.51 61.98,13.97 50.55,2.54 35.05,2.54
  pour Bottom (no thermals): 53.85,16.51 61.98,16.51 61.98,13.21 61.98,12.45 61.21,11.68 53.85,11.68
N$1
  Top 0.305: U$4.10 24.03,38.25 24.38,38.61 24.38,41.91 21.34,44.96 20.32,44.96 17.27,48.01 17.27,49.28 JP11.2
  Bottom 0.305: R10.1 16.26,50.29 JP11.2
N$2
  Top 0.305: U$4.11 23.07,42.21 21.08,44.2 20.07,44.2 17.53,46.74 14.99,46.74 13.97,47.75 JP11.1
  Bottom 0.305: R11.1 JP11.1
N$3  (via drill 0.8)
  Top 0.61: U$2.2 50.42,41.53 50.04,41.15 v45.97,41.15
  Bottom 0.61: v45.97,41.15 D2.C 48.26,41.28 48.26,43.43 51.31,46.48 L1.P$1
N$4
  Top 0.305: U$4.12 21.27,42.99 20.83,43.43 19.81,43.43 17.27,45.97 13.04,45.97 R8.1
N$5
  Top 0.61: JP4.1 35.05,48.77 33.78,50.04 23.96,50.04 Q1.3
  Bottom 0.61: D1.A 35.93,47.13 JP4.1
N$6
  Bottom 0.305: R16.2 37.59,51.56 39.88,53.85 43.43,53.85 44.45,54.86 44.45,55.37 JP9.1
N$7
  Bottom 0.305: R6.1 R7.2
N$8  (via drill 0.6)
  Top 0.406: Q5.1 45.73,19.55 44.96,20.32 38.1,20.32 37.59,19.81 37.08,19.81 | 37.08,19.81 Q7.1 | U$6.7 26.29,13.84 v27.43,14.99 | v35.81,19.81 37.08,19.81
  Bottom 0.406: v27.43,14.99 30.99,14.99 v35.81,19.81
N$9  (via drill 0.6)
  Top 0.406: Q1.1 19.12,49.72 v18.8,50.04
  Bottom 0.305: v18.8,50.04 19.05,49.28 R4.1
N$10  (via drill 0.6)
  Top 0.305: v9.4,12.45 11.81,12.45 R5.1 13.59,8.95 IC1.5
  Bottom 0.305: R6.2 10.92,10.92 | 10.92,10.92 v9.4,12.45 | C9.A 9.78,9.78 10.92,10.92
N$11
  Top 0.305: U$4.13 20.47,42.52 20.32,42.67 19.56,42.67 17.02,45.21 14.73,45.21 13.72,44.2 R9.1
N$12
  Bottom 0.305: R17.2 38.35,53.85 39.62,55.12 JP9.3
N$13
  Top 0.305: U$5.1 7.88,59.31 R18.2
N$14
  Top 0.305: R19.1 R20.2
N$15
  Top 0.406: Q6.1 50.29,11.17 49.28,10.16 41.66,10.16 | 41.66,10.16 26.42,10.16 25.4,11.18 22.79,11.18 U$6.5 | Q8.1 41.65,10.17 41.66,10.16
N$16
  Top 0.305: U$5.3 11.05,56.77 10.41,56.13 10.41,53.44 U$7.4
N$17
  Top 0.305: JP7.1 22.08,28.45 U$4.44
PDI_CLOCK
  Top 0.305: U$4.35 14.07,25.3 14.48,24.89 16.51,24.89 17.02,24.38 17.02,21.84 J1.5
  Bottom 0.305: J1.5 18.29,19.68 R2.1
PDI_DATA
  Top 0.305: U$4.34 13.27,25.34 14.48,24.13 14.48,21.84 J1.1
RELAY  (via drill 0.7)
  Top 0.305: U$4.16 18.07,42.63 v18.03,42.42
  Bottom 0.305: v18.03,42.42 18.03,43.56 R4.2
RXI
  Top 0.305: R18.1 R19.2 4.83,55.63 5.08,55.37 5.08,51.56 7.87,48.77 9.65,48.77 10.41,48.01 10.53,47.88 | 10.53,47.88 11.18,47.16 R8.2 | TP1.P$1 10.65,48.01 10.53,47.88
SCK  (via drill 0.7)
  Top 0.305: v7.87,25.91 7.87,26.42 7.11,27.18 6.1,27.18 5.33,27.94 5.33,34.29 6.9,35.85 U$4.27
  Bottom 0.305: v7.87,25.91 7.87,23.62 8.89,22.61 8.89,18.03 U$1.6
TOP_LIMIT
  Top 0.305: JP1.2 57.6,38.3 55.63,36.32 55.63,33.27 54.61,32.26 29.97,32.26 28.96,31.24 28.96,26.67 28.7,26.42 25.15,26.42 24.64,25.91 21.59,25.91 19.67,27.83 U$4.42
TRIG
  Top 0.305: U$4.23 10.73,39.05 10.16,39.62 10.16,41.58 S1.2 S1.1
TXO  (via drill 0.6)
  Top 0.305: R9.2 10.92,44.2 8.64,46.48 v8.64,47.24 | v9.4,54.86 U$7.2 9.4,49.78 9.65,49.53 TP2.P$1
  Bottom 0.305: v8.64,47.24 8.64,54.1 v9.4,54.86
VCC  (via drill 0.9)
  Top 0.406: U$6.6 36.73,12.57 Q8.3 | JP4.2 32.51,43.69 C3.1
  Top 0.61: v56.13,43.18 56.13,44.45 55.12,45.47 49.78,45.47 49.15,44.83 49.15,43.81 | U$2.1 49.15,43.81 | 49.15,43.81 49.02,43.69 38.61,43.69 C3.1
  Bottom 0.61: v56.13,43.18 56.13,32.71 JP3.2 | D1.C 31.63,47.13 JP4.2
  pour Top (no thermals): 35.05,15.24 38.1,15.24 38.61,15.75 38.61,18.54 39.62,19.56 42.93,19.56 43.43,19.05 43.43,16.26 42.42,15.24 40.64,15.24 39.88,14.48 39.88,10.67 35.05,10.67
  pour Top (no thermals): 34.54,28.19 60.96,28.19 60.96,30.48 59.94,31.5 30.73,31.5 29.72,30.48 29.72,12.7 31.75,10.67 35.05,10.67 35.05,18.54 34.29,19.3 34.29,27.94
WINDOW
  Top 0.305: U$4.22 12.91,40.85 12.45,40.39 11.18,40.39 10.67,40.89 10.67,42.16 9.91,42.93 9.91,43.94 7.11,46.74 3.56,46.74 2.79,47.5 JP8.2

### Text on the board
tPlace: A | GND | B | J1708 | TX | SCL | RX | SDA | Relay | 5V | GND | +12V | GND | GND | 1W | 1W | +3.3 | Top | Bottom | Trigger | Tristan Honscheid | June 2014 | +12V In | GND | PDI | PDI | MOTOR | Ethernet | MOTOR | Current Sensing
bPlace: Window Sensor